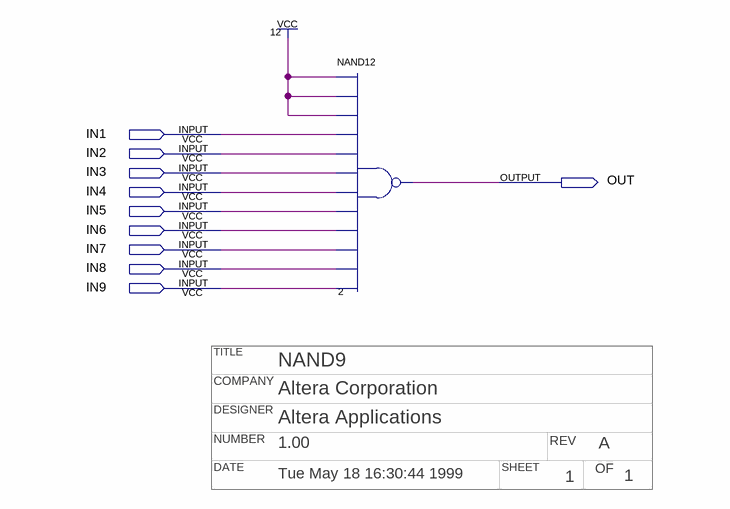
[diagram p0: schematic sheet]
// Quartus schematic nand9.bdf as structural Verilog: 1 symbols, 10 pins
// Title block: TITLE: NAND9; COMPANY: Altera Corporation; DESIGNER: Altera Applications; NUMBER: 1.00; REV: A; DATE: Tue May 18 16:30:44 1999; SHEET: 1; OF: 1
module nand9 (
  input  IN1,
  input  IN2,
  input  IN3,
  input  IN4,
  input  IN5,
  input  IN6,
  input  IN7,
  input  IN8,
  input  IN9,
  output OUT
);

  nand u_2 (OUT, 1'b1, 1'b1, 1'b1, IN1, IN2, IN3, IN4, IN5, IN6, IN7, IN8, IN9);
endmodule
